# EasyEDA schematic ESP Client.json
TITLE: Sheet_1; REV: 1.0; Date: 2020-12-30; Sheet: 1/1; Company: Your Company
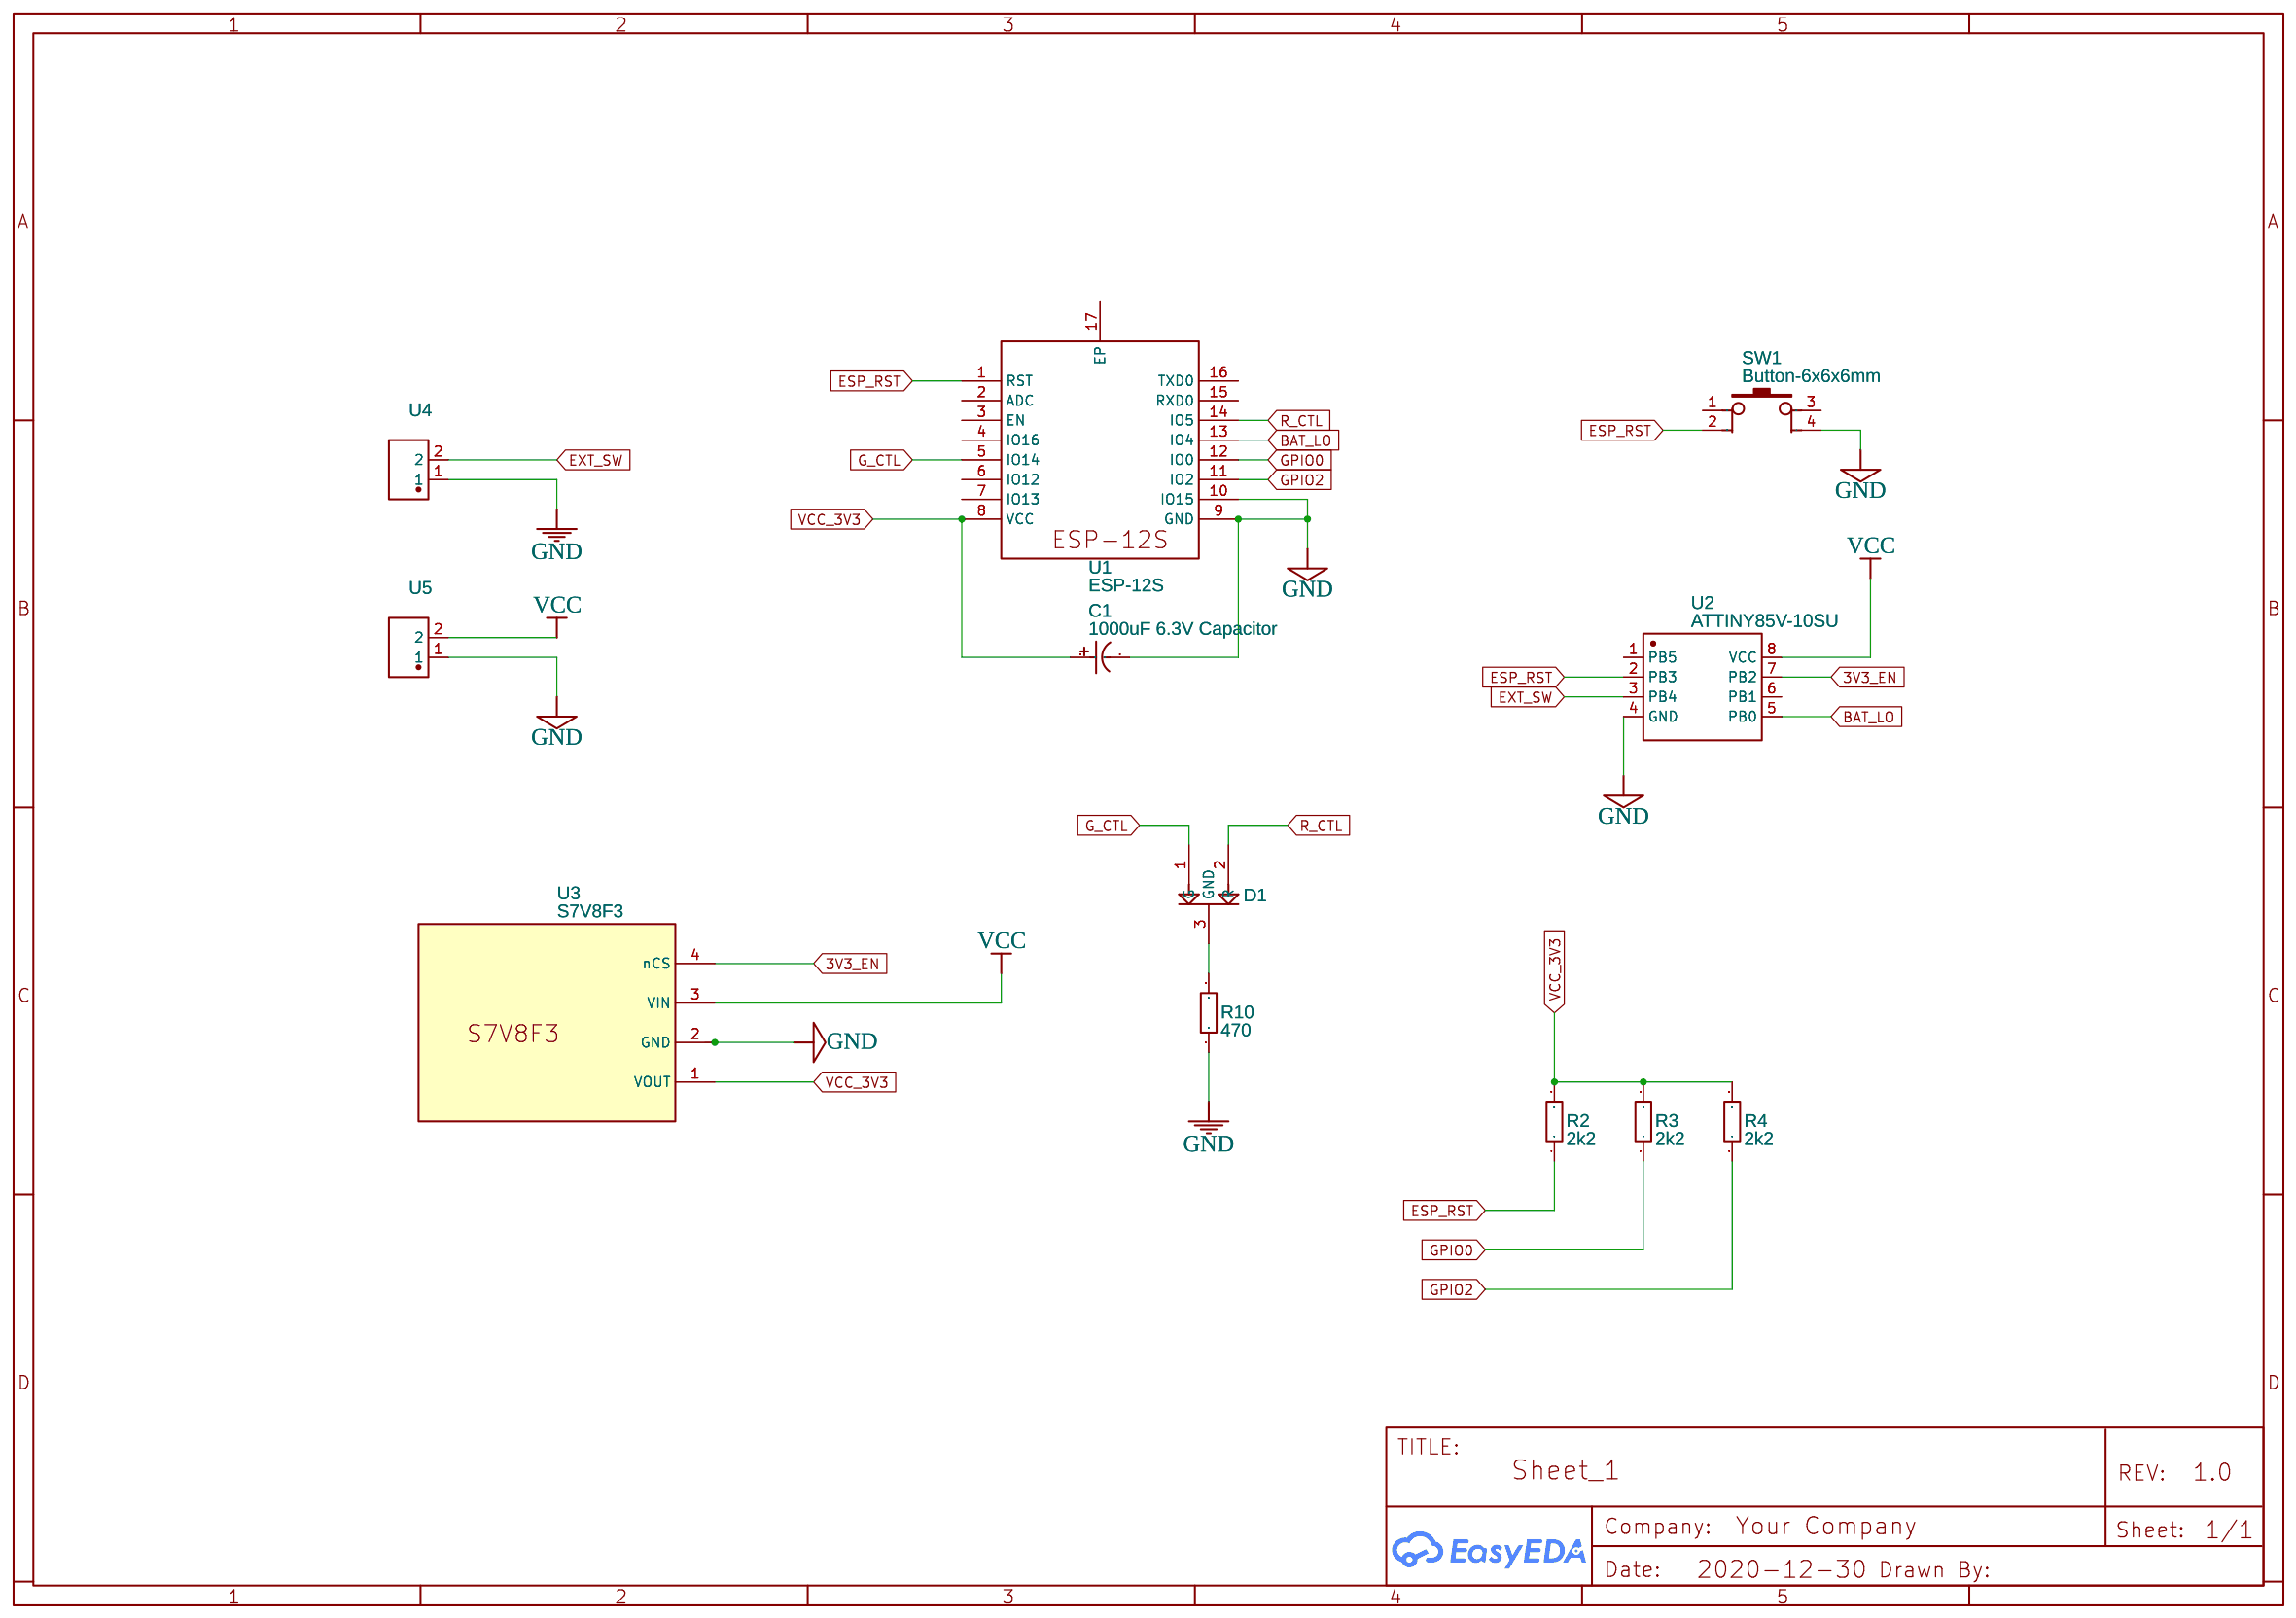
[diagram p0: schematic sheet]

## Parts
C1  1000uF 6.3V Capacitor  [1000UF 6.3V CAPACITOR]
D1  RED GREEN CATODO  [LED GREEN RED CATODO]
R2  2k2  [AXIAL-0.5]
R3  2k2  [AXIAL-0.5]
R4  2k2  [AXIAL-0.5]
R10  470  [AXIAL-0.4]
SW1  Button-6x6x6mm  [SW-TH_4PIN-L6.00-W6.00]
U1  ESP-12S  [WIRELM-SMD_ESP-12S]
U2  ATTINY85V-10SU  [SOIC-8_L5.3-W5.3-P1.27-LS8.0-BL]
U3  S7V8F3  [S7V8F3]
U4  XY301V-A-5.0-2P  [CONN-TH_XY301V-A-5.0-2P]
U5  XY301V-A-5.0-2P  [CONN-TH_XY301V-A-5.0-2P]

## Library data of the parts
C1 = 1000uF 6.3V Capacitor: Contributor: l0_0t
D1 = RED GREEN CATODO: DIP LED Red/Green Common anode;; Manufacturer Part: RG309WK-C; sourceId: UPztnFzH3; Contributor: SCROSTH
R2-R4 = 2k2: Power: 1/2W; Tolerance: ±5%; EasyEDA: C69874; Supplier Part: C69874; Supplier: EasyEDA; Manufacturer Part: CFR02SJ0220A10
R10 = 47Ω: Supplier: LCSC; Manufacturer: UniOhm; Manufacturer Part: MFR0W4F4700A50; Supplier Part: C58592
SW1 = Button-6x6x6mm: Supplier Part: C71836; Supplier: LCSC; Manufacturer: BBJ; Manufacturer Part: Switch,6*6*6Plastic head,260G, 0.25mm,Straight line
U1 = ESP-12S: Supplier: LCSC; Manufacturer: Ai-Thinker; Contributor: LCSC; Supplier Part: C82898
U2 = ATTINY85V-10SU: Supplier: LCSC; Supplier Part: C152192; Manufacturer: Microchip Tech; Contributor: LCSC; SMT Type: Extend; JLCPCB SMD: Yes
U3 = S7V8F3: Contributor: winter2015; sourceId: YsmgyP7pj
U4 U5 = XY301V-A-5.0-2P: Supplier: LCSC; Supplier Part: C557651; Manufacturer: --; Contributor: LCSC

## Nets
3V3_EN: U2.7(PB2) U3.4(nCS)
GND: C1.2 R10.1 SW1.4 U1.9(GND) U1.10(IO15) U2.4(GND) U3.2(GND) U4.1 U5.1
VCC: U2.8(VCC) U3.3(VIN) U5.2
VCC_3V3: C1.1 R2.2 R3.2 R4.2 U1.8(VCC) U3.1(VOUT)
BAT_LO: U1.13(IO4) U2.5(PB0)
ESP_RST: R2.1 SW1.2 U1.1(RST) U2.2(PB3)
EXT_SW: U2.3(PB4) U4.2
G_CTL: D1.1(G) U1.5(IO14)
GPIO0: R3.1 U1.12(IO0)
GPIO2: R4.1 U1.11(IO2)
R_CTL: D1.2(R) U1.14(IO5)
Net-(D1-3): D1.3(GND) R10.2

Not connected (* = marked no-connect by the designer): SW1 1 3; U1 2(ADC) 3(EN) 4(IO16) 6(IO12) 7(IO13) 15(RXD0) 16(TXD0) 17(EP); U2 1(PB5) 6(PB1)
